# EAGLE schematic board (EAGLE 9.0.1)
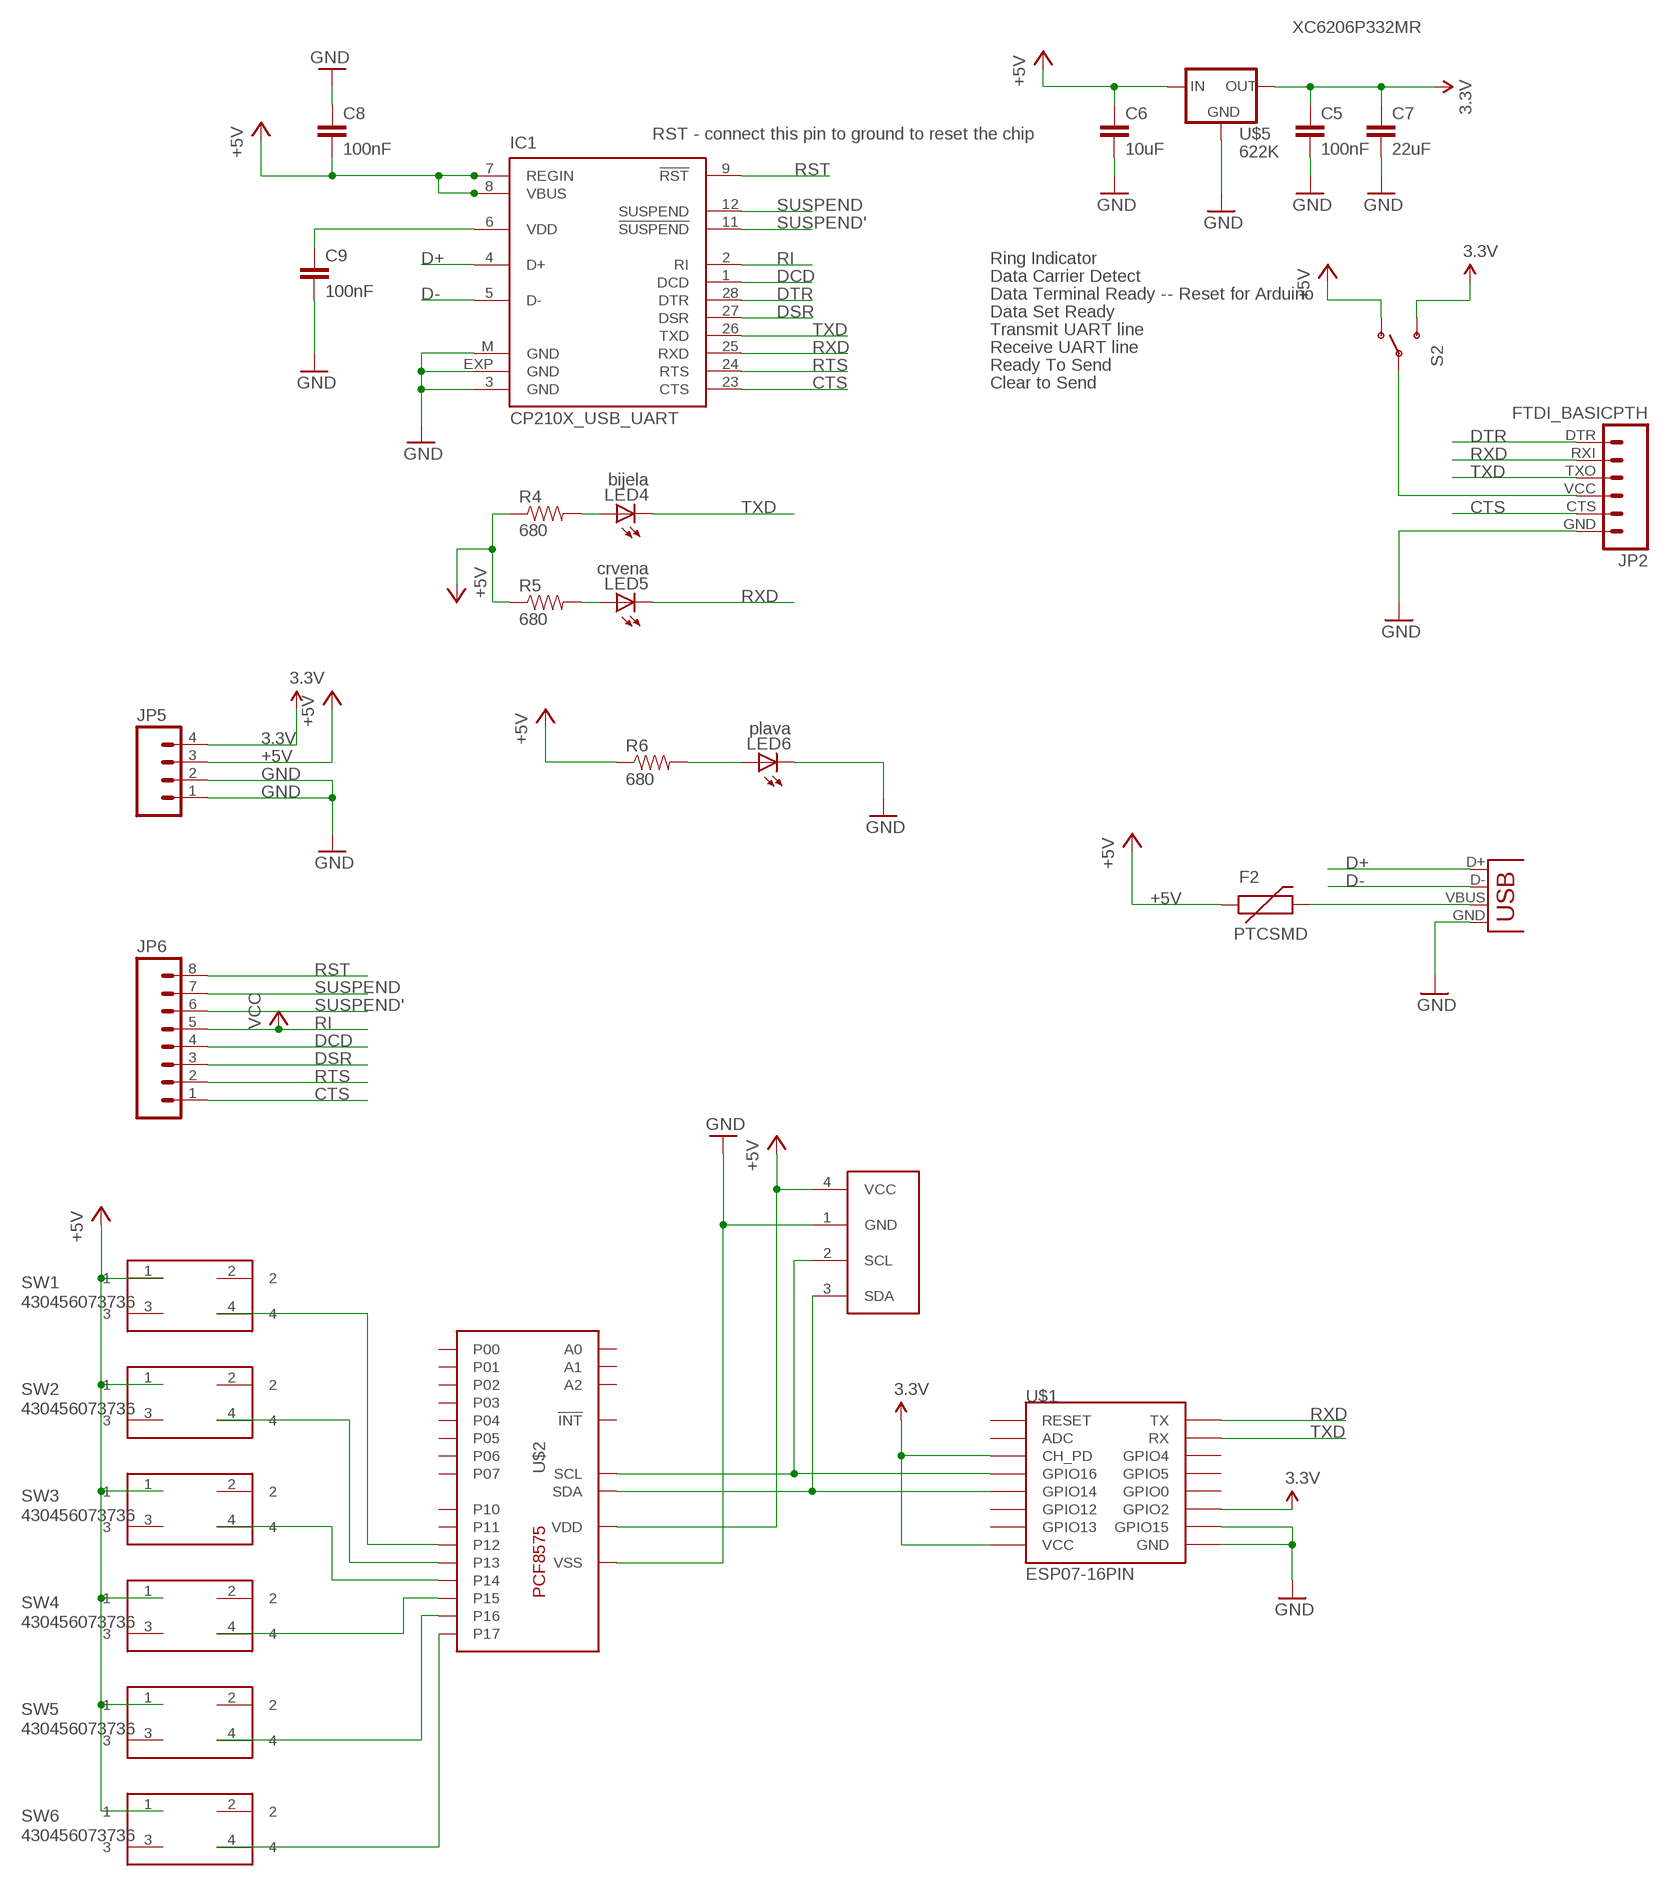
[diagram p0: schematic, sheet 1]

## Parts
C5  100nF  CAP0603-CAP  [0603-CAP]
C6  10uF  C-EUC3216  [C3216]
C7  22uF  C-EUC3216  [C3216]
C8  100nF  CAP0603-CAP  [0603-CAP]
C9  100nF  CAP0603-CAP  [0603-CAP]
F2  PTCSMD  [PTC-1206]
IC1  CP210X_USB_UART  [MLP28]
JP2  FTDI_BASICPTH  [FTDI_BASIC]
JP5  M04PTH  [1X04]
JP6  M081X08  [1X08]
LED4  bijela  LEDCHIP-LED0805  [CHIP-LED0805]
LED5  crvena  LEDCHIP-LED0805  [CHIP-LED0805]
LED6  plava  LEDCHIP-LED0805  [CHIP-LED0805]
R4  680  RESISTOR0603-RES  [0603-RES]
R5  680  RESISTOR0603-RES  [0603-RES]
R6  680  RESISTOR0603-RES  [0603-RES]
S2  SWITCH-SPST-SMD-A  [SWITCH-SPST-SMD-A]
SW1  430456073736  [430456073736]
SW2  430456073736  [430456073736]
SW3  430456073736  [430456073736]
SW4  430456073736  [430456073736]
SW5  430456073736  [430456073736]
SW6  430456073736  [430456073736]
U$1  ESP07-16PIN  [ESP07-16PIN]
U$2  PCF8575C  [SOP24]
U$3  I2C_OLED  [I2C_OLED_PACKAGE]
U$5  622K  [662K]
X2  USB-MICROB  [USB-MICROB]

## Nets
3.3V: C5.1 C7.1 JP5.4 S2.3(S) U$1.CH_PD U$1.GPIO2 U$1.VCC U$5.OUT
+5V: C6.1 C8.2 F2.1 IC1.7(REGIN) IC1.8(VBUS) JP5.3 R4.1 R5.1 R6.1 S2.1(O) SW1.1 SW2.1 SW3.1 SW4.1 SW5.1 SW6.1 U$2.P$24(VDD) U$3.4(VCC) U$5.IN
CTS: IC1.23(CTS) JP2.CTS JP6.1
D+: IC1.4(D+) X2.D+
D-: IC1.5(D-) X2.D-
DCD: IC1.1(DCD) JP6.4
DSR: IC1.27(DSR) JP6.3
DTR: IC1.28(DTR) JP2.DTR
GND: C5.2 C6.2 C7.2 C8.1 C9.2 IC1.3(GND) IC1.EXP(GND) IC1.M(GND) JP2.GND JP5.1 JP5.2 LED6.C U$1.GND U$1.GPIO15 U$2.P$12(VSS) U$3.1(GND) U$5.GND X2.GND
N$1: U$1.GPIO14 U$2.P$23(SDA) U$3.3(SDA)
N$2: U$1.GPIO16 U$2.P$22(SCL) U$3.2(SCL)
N$3: SW6.4 U$2.P$20(P17)
N$4: SW5.4 U$2.P$19(P16)
N$5: LED4.A R4.2
N$6: LED5.A R5.2
N$7: LED6.A R6.2
N$8: C9.1 IC1.6(VDD)
N$9: SW4.4 U$2.P$18(P15)
N$10: SW3.4 U$2.P$17(P14)
N$11: SW2.4 U$2.P$16(P13)
N$12: SW1.4 U$2.P$15(P12)
RI: IC1.2(RI) JP6.5 ; supply symbol labelled VCC
RST: IC1.9(!RST) JP6.8
RTS: IC1.24(RTS) JP6.2
RXD: IC1.25(RXD) JP2.RXI LED5.C U$1.TX
SUSPEND: IC1.12(SUSPEND) JP6.7
SUSPEND': IC1.11(!SUSPEND) JP6.6
TXD: IC1.26(TXD) JP2.TXO LED4.C U$1.RX
VBUS1: F2.2 X2.VBUS
VCC1: JP2.VCC S2.2(P)
Unconnected: SW1.2 SW1.3 SW2.2 SW2.3 SW3.2 SW3.3 SW4.2 SW4.3 SW5.2 SW5.3 SW6.2 SW6.3 U$1.ADC U$1.GPIO0 U$1.GPIO4 U$1.GPIO5 U$1.GPIO12 U$1.GPIO13 U$1.REST(RESET) U$2.P$1(!INT) U$2.P$2(A1) U$2.P$3(A2) U$2.P$4(P00) U$2.P$5(P01) U$2.P$6(P02) U$2.P$7(P03) U$2.P$8(P04) U$2.P$9(P05) U$2.P$10(P06) U$2.P$11(P07) U$2.P$13(P10) U$2.P$14(P11) U$2.P$21(A0)

## Notes on the sheet
- XC6206P332MR
- RST - connect this pin to ground to reset the chip
- Ring Indicator
- Data Carrier Detect
- Data Terminal Ready -- Reset for Arduino
- Data Set Ready
- Transmit UART line
- Receive UART line
- Ready To Send
- Clear to Send

## Library data of the parts
C5 C8 C9 = SparkFun:CAP: Capacitor Standard 0603 ceramic capacitor, and 0.1" leaded capacitor.
C6 C7 = rcl:C-EU: CAPACITOR, European symbol
F2 = SparkFun:PTC: Resettable Fuse PTC Resettable Fuse. Spark Fun Electronics SKU : COM-08357
IC1 = SparkFun-DigitalIC:CP210X_USB_UART: Single-Chip USB to UART Bridge Source: www.silabs.com .. CP2101.pdf / cp2102.pdf. Spark Fun Electronics SKU : COM-00310
JP2 = SparkFun:FTDI_BASIC: FTDI Basic: 3.3V and 5V
JP5 = SparkFun:M04: Header 4 Standard 4-pin 0.1" header. Use with straight break away headers (SKU : PRT-00116), right angle break away headers (PRT-00553), swiss pins (PRT-00743), machine pins (PRT-00117), and female headers (PRT-00115). Molex polarized connector foot print use with SKU : PRT-08231 with associated crimp pins and housings. 1MM SMD Version SKU: PRT-10208
JP6 = SparkFun:M08: Header 8 Standard 8-pin 0.1" header. Use with straight break away headers (SKU : PRT-00116), right angle break away headers (PRT-00553), swiss pins (PRT-00743), machine pins (PRT-00117), and female headers (PRT-00115).
LED4-LED6 = adafruit:LED: LED OSRAM: - CHIPLED LG R971, LG N971, LY N971, LG Q971, LY Q971, LO R971, LY R971 LH N974, LH R974 LS Q976, LO Q976, LY Q976 LO Q996 - Hyper CHIPLED LW Q18S LB Q993, LB Q99A, LB R99A - SideLED LS A670, LO A670, LY A670, LG A670, LP A670 LB A673, LV A673, LT A673, LW A673 LH A674 LY A675 LS A676, LA A676, LO A676, LY A676, LW A676 LS A679, LY A679, LG A679 - Hyper Micro SIDELED® LS Y876, LA Y876, LO Y876, LY Y876 LT Y87S - SmartLED LW L88C, LW L88S LB L89C, LB L89S, LG L890 LS L89K, LO L89K, LY L89K LS L896, LA L896, LO L896, LY L896 - TOPLED LS T670, LO T670, LY T670, LG T670, LP T670 LSG T670, LSP T670, LSY T670, LOP T670, LYG T670 LG T671, LOG T671, LSG T671 LB T673, LV T673, LT T673, LW T673 LH T674 LS T676, LA T676, LO T676, LY T676, LB T676, LH T676, LSB T676, LW T676 LB T67C, LV T67C, LT T67C, LS T67K, LO T67K, LY T67K, LW E67C LS E67B, LA E67B, LO E67B, LY E67B, LB E67C, LV E67C, LT E67C LW T67C LS T679, LY T679, LG T679 LS T770, LO T770, LY T770, LG T770, LP T770 LB T773, LV T773, LT T773, LW T773 LH T774 LS E675, LA E675, LY E675, LS T675 LS T776, LA T776, LO T776, LY T776, LB T776 LHGB T686 LT T68C, LB T68C - Hyper Mini TOPLED® LB M676 - Mini TOPLED Santana® LG M470 LS M47K, LO M47K, LY M47K Source: http://www.osram.convergy.de/
R4-R6 = SparkFun:RESISTOR: Resistor Basic schematic elements and footprints for 0603, 1206, and PTH resistors.
S2 = SparkFun:SWITCH-SPST: SPST Switch Simple slide switch. Spark Fun Electronics SKU : COM-00102
SW1-SW6 = Wurth_Elektronik_Electromechanic_Switchs_rev15b:430456073736: WS-TSW, 12*12mm horizontal type washable Tact switch, ,THT, 4 pins, height 7.3mm, square salmon actuator, 360gf
U$1 = esp8266modules:ESP07-16PIN: ESP8266 Wifi module 07 - 16 pins; DIMENSIONS: 22.0 x 16.0 mm; PINS: 16; PITCH: 0.078" / 2 mm
U$2 = pcf8575c:PCF8575C
U$3 = DIYMall_OLED:I2C_OLED
U$5 = SparkFun:622K
X2 = SparkFun:USB: USB Connectors USB-B-PTH is fully proven SKU : PRT-00139 USB-miniB is fully proven SKU : PRT-00587 USB-A-PCB is untested. USB-A-H is throughly reviewed, but untested. Spark Fun Electronics SKU : PRT-00437 USB-B-SMT is throughly reviewed, but untested. Needs silkscreen touching up. USB-A-S has not been used/tested USB-MB-H has not been used/tested